# Altium schematic sheet WifiNode_Pwr_R00.SchDoc: WifiNode_Pwr_R00
size A4; Author: Sfara, Gonzalo Agustín; CompanyName: Introducción al Diseño de Circuitos Impresos; Organization: UTN FRBA; Revision: 00; SheetNumber: 2; SheetTotal: 6
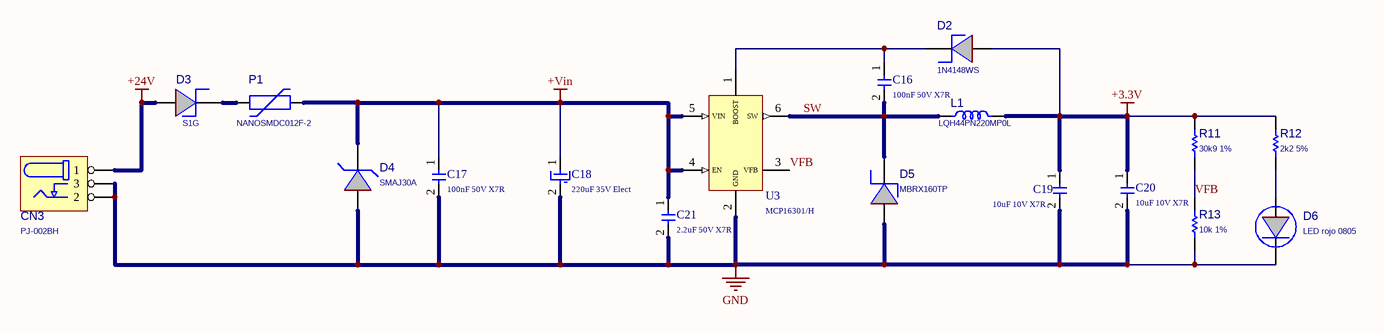
[diagram p0: WifiNode_Pwr_R00.SchDoc]

## Parts
C16  100nF 50V X7R  [C_0805]
C17  100nF 50V X7R  [C_0805]
C18  220uF 35V Elect  [C_RAD_0.135_H_8X12_S]
C19  10uF 10V X7R  [C_0805]
C20  10uF 10V X7R  [C_0805]
C21  2.2uF 50V X7R  [C_1206]
CN3  PJ-002BH  [PJ002B]
D2  1N4148WS  [D_0805]
D3  S1G  [D_SMA]
D4  SMAJ30A  [D_SMA]
D5  MBRX160TP  [SOD_123]
D6  LED rojo 0805  [D_0805]
L1  LQH44PN220MP0L  [LQH44]
P1  NANOSMDC012F-2  [NANOSMDC]
R11  30k9 1%  [R_0805]
R12  2k2 5%  [R_0805]
R13  10k 1%  [R_0805]
U3  MCP16301/H  [SOT23-6]

## Nets
+3.3V: C19.1 C20.1 D2.1(A) L1.2 R11.2 R12.2
+24V: CN3.1 D3.1(A)
+Vin: C17.1 C18.1 C21.1 D4.2(K) P1.2 U3.4(EN) U3.5(VIN)
GND: C17.2 C18.2 C19.2 C20.2 C21.2 CN3.2 CN3.3 D4.1(A) D5.1(A) D6.2(K) R13.1 U3.2(GND)
SW: C16.2 D5.2(K) L1.1 U3.6(SW)
VFB: R11.1 R13.2 U3.3(VFB)
NetC16_1: C16.1 D2.2(K) U3.1(BOOST)
NetD3_2: D3.2(K) P1.1
NetD6_1: D6.1(A) R12.1

## Notes on the sheet
- Title:
- Size:
- Author:
- A4
- Sheet
- of
- Revision:
- File:
- Date:

## Library data of the parts
C16 C17 C19-C21 = CAP_NP: Not polarized capacitor
C18 = CAP_P: Polarized capacitor
CN3 = CN_PowerJack: Barrel Power Connector
D2 D3 D5 = DIODO_SH: Diode Shottky
D4 = DIODE_TVS_1: Unidirectional TVS
D6 = LED_1: LED
L1 = IND: Inductor
P1 = PLYSW: Polyswitch
R11-R13 = Res1: Resistor